# EAGLE design Aegaeon REV B 20130222 (EAGLE 6.1)
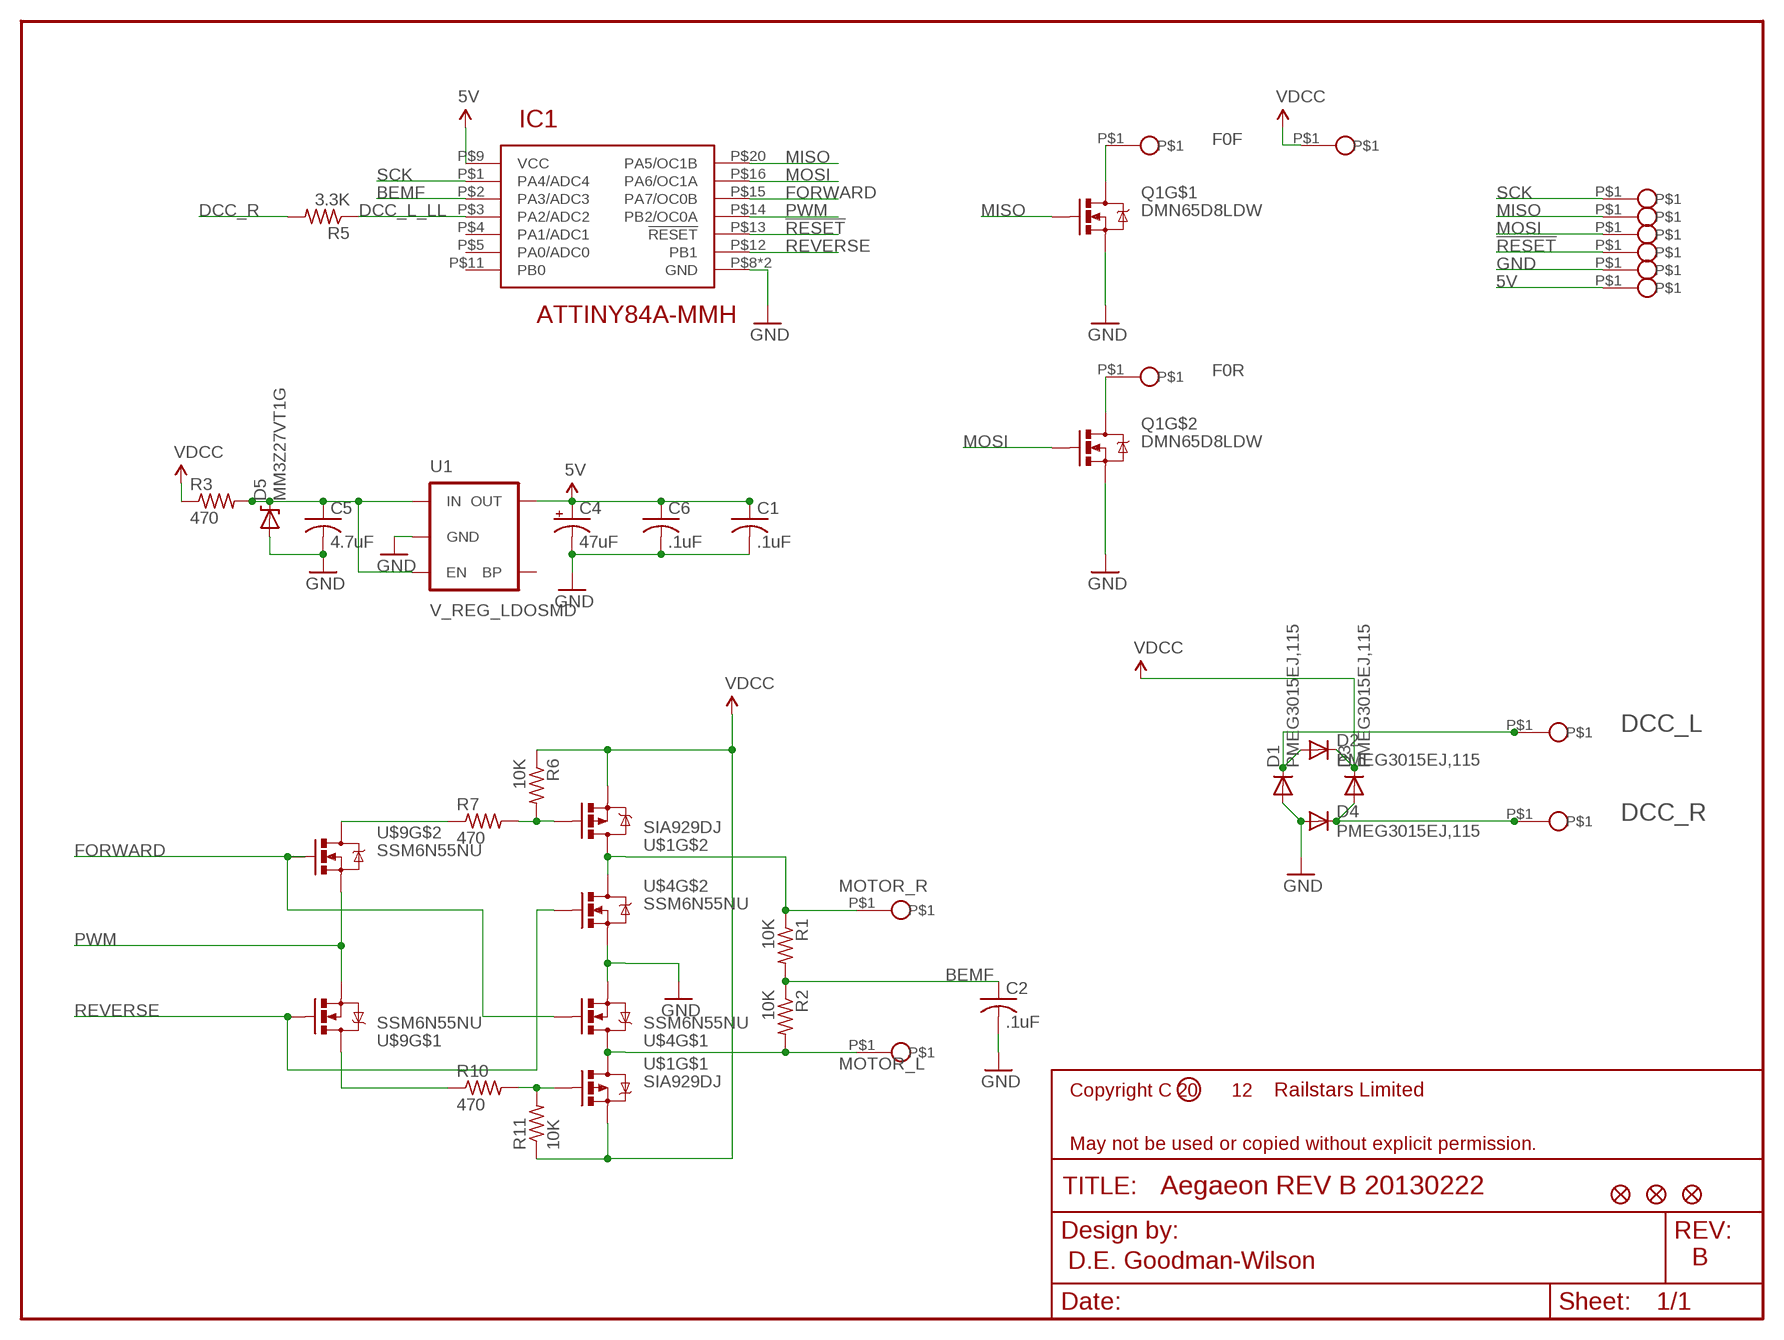
[diagram p0: schematic, sheet 1]

## Parts
C1  .1uF  C-USC0201  [C0201]
C2  .1uF  C-USC0402  [C0402]
C4  47uF  CPOL-USF980J476MMA  [CPOL0603]
C5  4.7uF  C-USC0603  [C0603]
C6  .1uF  C-USC0402  [C0402]
D1  PMEG3015EJ,115  DIODESOD  [SOD-323]
D2  PMEG3015EJ,115  DIODESOD  [SOD-323]
D3  PMEG3015EJ,115  DIODESOD  [SOD-323]
D4  PMEG3015EJ,115  DIODESOD  [SOD-323]
D5  MM3Z27VT1G  DIODE-ZENER-BZT52  [SOD-323]
DCC_L  PAD1MM  [LED_SOLDER_PAD]
DCC_R  PAD1MM  [LED_SOLDER_PAD]
IC1  ATTINY84A-MMH  [VQFN-20]
JP1  FIDUCIALUFIDUCIAL  [MICRO-FIDUCIAL]
JP2  FIDUCIALUFIDUCIAL  [MICRO-FIDUCIAL]
JP4  FIDUCIALUFIDUCIAL  [MICRO-FIDUCIAL]
Q1  DMN65D8LDW  [SOT363]
R1  10K  R-US_R0201  [R0201]
R2  10K  R-US_R0201  [R0201]
R3  470  R-US_R0201  [R0201]
R5  3.3K  R-US_R0201  [R0201]
R6  10K  R-US_R0201  [R0201]
R7  470  R-US_R0201  [R0201]
R10  470  R-US_R0201  [R0201]
R11  10K  R-US_R0201  [R0201]
U1  V_REG_LDOSMD  [SOT23-5]
U$1  SIA929DJ  [SC70-6L]
U$2  PAD1MM  [LED_SOLDER_PAD]
U$3  PAD1MM  [LED_SOLDER_PAD]
U$4  SSM6N55NU  [UDFN6]
U$5  PAD1MM  [LED_SOLDER_PAD]
U$9  SSM6N55NU  [UDFN6]
U$10  PAD1MM  [LED_SOLDER_PAD]
U$11  PAD1MM  [LED_SOLDER_PAD]
U$14  PAD.75MM  [POGO_PAD]
U$15  PAD.75MM  [POGO_PAD]
U$16  PAD.75MM  [POGO_PAD]
U$17  PAD.75MM  [POGO_PAD]
U$18  PAD.75MM  [POGO_PAD]
U$19  PAD.75MM  [POGO_PAD]

## Nets
5V: C1.1 C4.1(+) C6.1 IC1.P$9(VCC) U1.5(OUT) U$19.P$1
!RESET: IC1.P$13(!RESET) U$17.P$1
BEMF: C2.1 IC1.P$2(PA3/ADC3) R1.2 R2.1
DCC_L: D1.1(C) D2.2(A) DCC_L.P$1
DCC_L_LL: IC1.P$3(PA2/ADC2) R5.1
DCC_R: D3.2(A) D4.1(C) DCC_R.P$1 R5.2
F0F: Q1.P$4(D) U$10.P$1
F0R: Q1.P$1(D) U$5.P$1
FORWARD: IC1.P$15(PA7/OC0B) U$4.G1(G) U$9.G2(G)
GND: C1.2 C2.2 C4.2(-) C5.2 C6.2 D1.2(A) D4.2(A) D5.2(A) IC1.P$8(GND) IC1.P$21(GND) Q1.P$3(S) Q1.P$6(S) U1.2(GND) U$4.S1(S) U$4.S2(S) U$18.P$1
MISO: IC1.P$20(PA5/OC1B) Q1.P$2(G) U$15.P$1
MOSI: IC1.P$16(PA6/OC1A) Q1.P$5(G) U$16.P$1
MOTOR_L: R2.2 U$1.D1$2(D) U$1.D1(D) U$3.P$1 U$4.D1$1(D) U$4.D1(D)
MOTOR_R: R1.1 U$1.D2$2(D) U$1.D2(D) U$2.P$1 U$4.D2$2(D) U$4.D2(D)
N$1: R6.2 R7.2 U$1.G2(G)
N$2: C5.1 D5.1(C) R3.2 U1.1(IN) U1.3(EN)
N$4: R10.2 R11.2 U$1.G1(G)
N$10: R10.1 U$9.D1$1(D) U$9.D1(D)
N$11: R7.1 U$9.D2$2(D) U$9.D2(D)
PWM: IC1.P$14(PB2/OC0A) U$9.S1(S) U$9.S2(S)
REVERSE: IC1.P$12(PB1) U$4.G2(G) U$9.G1(G)
SCK: IC1.P$1(PA4/ADC4) U$14.P$1
VDCC: D2.1(C) D3.1(C) R3.1 R6.1 R11.1 U$1.S1(S) U$1.S2(S) U$11.P$1
Unconnected: IC1.P$4(PA1/ADC1) IC1.P$5(PA0/ADC0) IC1.P$11(PB0) U1.4(BP)

## Notes on the sheet
- 12 | Railstars Limited
- D.E. Goodman-Wilson | B

## Library data of the parts
C1 C2 C5 C6 = rcl:C-US: CAPACITOR, American symbol
C4 = rcl:CPOL-US: POLARIZED CAPACITOR, American symbol
D1-D4 = Railstars:DIODE: Diode These are standard reverse protection diodes and small signal diodes. SMA package can handle up to about 1A. SOD-323 can handle about 200mA. What the SOD-323 package when ordering, there are some mfgs out there that are 5-pin packages.
D5 = SparkFun-DiscreteSemi:DIODE-ZENER: Zener Diode Production Part - 8199 3.4V Zener Voltage
DCC_L DCC_R U$2 U$3 U$5 U$10 U$11 U$14-U$19 = Railstars:PAD
IC1 = Railstars:ATTINY84A
JP1 JP2 JP4 = SparkFun-Aesthetics:FIDUCIAL: Fiducial Alignment Points Various fiducial points for machine vision alignment.
Q1 = Railstars:DMN65D8LDW
R1-R3 R5-R7 R10 R11 = rcl:R-US_: RESISTOR, American symbol
U1 = SparkFun-PowerIC:V_REG_LDO: Voltage Regulator LDO Standard 150mA LDO voltage regulator in SOT-23 layout. Micrel part MIC5205. BP (by-pass) pin is used to lower output noise with 470pF cap.
U$1 = Railstars:SIA929DJ
U$4 U$9 = Railstars:SSM6N55NU

## Board
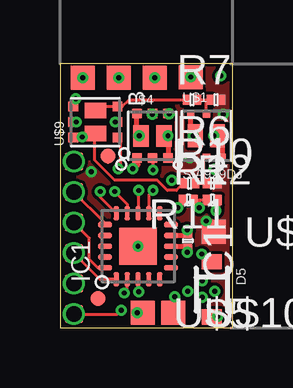
[diagram p1: board, top side]
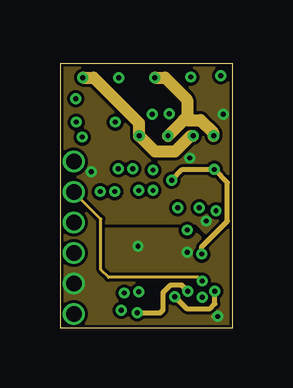
[diagram p2: board, inner layer Route8]
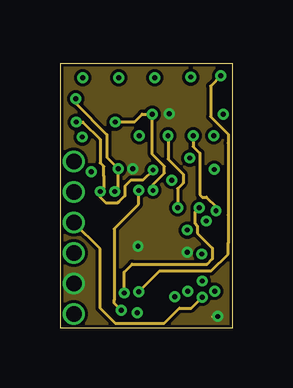
[diagram p3: board, inner layer Route9]
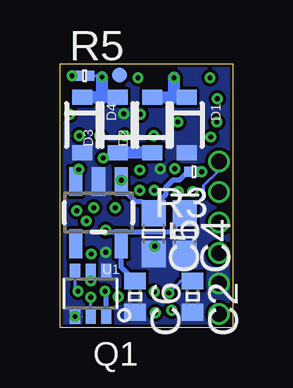
[diagram p4: board, bottom side, seen from below]

Size 7.2 x 11 mm. Coordinates in mm from the lower left corner, seen from the top.
Outline: 0,0 7.2,0 7.2,11 0,11 0,0
Copper layers (1*8+9*16): Top 0.035mm / dielectric 0.15mm / Route8 0.035mm / dielectric 0.15mm / Route9 0.035mm / dielectric 0.15mm / Bottom 0.035mm
Design rules: minimum track width 5mil, minimum drill 0.2mm, track to track 5mil, track to pad 5mil, pad to pad 5mil, via to via 5mil, smd to smd 0mil, copper to edge 5mil, drill to drill 10mil, minimum pad ring 5mil, minimum via ring 5mil, stop-mask expansion 0.05mm, vias tented up to drill 100mil, thermal gap 0.25mm

### Footprints (pad centres in the part's own frame; a part is rotated, then mirrored left to right if it is on the bottom)
C0201 = smd 0.25 x 0.35: 1 -0.25,0; 2 0.25,0
C0402 = smd 0.7 x 0.9: 1 -0.65,0; 2 0.65,0
CPOL0603 = smd 1.1 x 1: 1 -0.85,0; 2 0.85,0
C0603 = smd 1.1 x 1: 1 -0.85,0; 2 0.85,0
SOD-323 = smd 0.63 x 0.83: 1 -1.15,0; 2 1.15,0
LED_SOLDER_PAD = smd 1 x 1: P$1 0,0
VQFN-20 = smd 0.6 x 0.22: P$1 -1.375,0.9; P$2 -1.375,0.45; P$3 -1.375,0; P$4 -1.375,-0.45; P$5 -1.375,-0.9; P$11 1.375,-0.9; P$12 1.375,-0.45; P$13 1.375,0; P$14 1.375,0.45; P$15 1.375,0.9 | smd 0.22 x 0.6: P$6 -0.9,-1.375; P$7 -0.45,-1.375; P$8 0,-1.375; P$9 0.45,-1.375; P$10 0.9,-1.375; P$16 0.9,1.375; P$17 0.45,1.375; P$18 0,1.375; P$19 -0.45,1.375; P$20 -0.9,1.375 | smd 1.55 x 1.55: P$21 0,0
MICRO-FIDUCIAL = smd 0.635 x 0.635: 1 0,0
SOT363 = smd 0.42 x 0.6: P$1 -0.65,0.95; P$2 0,0.95; P$3 0.65,0.95; P$4 0.65,-0.95; P$5 0,-0.95; P$6 -0.65,-0.95
R0201 = smd 0.28 x 0.43: 1 -0.255,0; 2 0.255,0
SOT23-5 = smd 0.55 x 1.2: 1 -0.95,-1.3; 2 0,-1.3; 3 0.95,-1.3; 4 0.95,1.3; 5 -0.95,1.3
SC70-6L = smd 0.3 x 0.325: D1 -0.65,0.912; D2 0.65,-0.912; G1 0,-0.912; G2 0,0.912; S1 -0.65,-0.912; S2 0.65,0.912 | smd 0.613 x 0.95: D1$2 -0.467,0; D2$2 0.467,0
UDFN6 = smd 0.4 x 0.4: D1 -0.65,0.925; D2 0.65,-0.925; G1 0,-0.925; G2 0,0.925; S1 -0.65,-0.925; S2 0.65,0.925 | smd 0.65 x 0.9: D1$1 -0.475,0; D2$2 0.475,0
POGO_PAD = smd 0.75 x 0.75: P$1 0,0

### Placement (x,y rotation side)
C1  5.33,3.62 270 top
C2  1.67,1.3 270 bottom
C4  2,3.92 270 bottom
C5  3.3,3.92 270 bottom
C6  4.08,1.3 270 bottom
D1  1.92,8.45 270 bottom
D2  3.35,8.45 90 bottom
D3  4.8,8.45 90 bottom
D4  6.28,8.45 270 bottom
D5  6.33,1.6 270 top
DCC_L  2.45,10.43 0 top
DCC_R  5.45,10.45 0 top
IC1  3.25,3.4 90 top
JP1  1.58,1.23 0 top
JP2  2,7.15 0 top
JP4  4.73,10.53 0 bottom
Q1  5.93,1.43 180 bottom
R1  5.35,5.33 0 top
R2  6.35,5.33 0 top
R3  1.62,6.5 180 bottom
R5  6.18,10.5 0 bottom
R6  6.5,9.5 180 top
R7  5.5,9.5 0 top
R10  5.4,6.03 0 top
R11  6.35,6.03 180 top
U1  5.6,4.8 180 bottom
U$1  6.1,8 0 top
U$2  3.95,10.43 0 top
U$3  0.95,10.43 0 top
U$4  3.85,8 0 top
U$5  3.44,0.62 0 top
U$9  1.48,8.57 90 top
U$10  4.71,0.62 0 top
U$11  6.4,4 0 top
U$14  0.57,3.12 0 top
U$15  0.57,4.38 0 top
U$16  0.57,5.66 0 top
U$17  0.57,0.57 0 top
U$18  0.57,1.84 0 top
U$19  0.57,6.92 0 top

### Tracks (layer width: path | path; a pad name or v marks a point on that pad's centre or on a via)
5V  (via drill 0.2, 0.65)
  Top 0.127: 5.3,3.85 C1.1
  Top 0.2: v5.3,4.08 C1.1 5.3,3.85 IC1.P$9
  Bottom 0.127: U$19.P$1 0.57,6.58 1.23,5.92 1.23,5.47 1.58,5.12 1.65,5.12 C4.1
  Bottom 0.2: C4.1 2.4,4.38 2.4,4.15 2.57,3.98 4.65,3.98 | C6.1 4.65,2.52 U1.5 4.65,3.65 4.65,3.98 | 4.65,3.98 5.2,3.98 v5.3,4.08
  other vias: 0.57,6.92
!RESET  (via drill 0.2, 0.65)
  Top 0.127: v3.27,5.72 3.25,5.7 IC1.P$13 | U$17.P$1 2.4,0.57 v2.55,0.73
  Route9 0.127: v3.27,5.72 3.27,5.15 2.25,4.12 2.25,1.15 2.25,1.03 v2.55,0.73
  other vias: 0.57,0.57
BEMF  (via drill 0.2)
  Top 0.127: R2.1 5.8,5.33 | 5.8,5.33 v5.8,5 5.8,5.33 | R1.2 5.8,5.33 | v2.67,1.45 2.8,1.57 IC1.P$2
  Route9 0.127: v2.67,1.45 2.67,2.33 3,2.65 6.12,2.65 6.35,2.88 6.35,3.33 5.73,3.95 5.73,4.25 5.62,4.35 5.62,4.83 v5.8,5
  Bottom 0.127: C2.1 2.17,1.95 v2.67,1.45
DCC_L  (via drill 0.2)
  Bottom 0.5: D2.2 D1.1 2.45,9.6 DCC_L.P$1
  other vias: 2.45,10.43
DCC_L_LL  (via drill 0.2)
  Top 0.127: v3.27,1.5 3.25,1.52 IC1.P$3
  Route9 0.127: v6.7,10.5 6.28,10.07 6.28,8.8 7,8.07 7,7.7 7,4.7 7,3.52 7,3.08 6.3,2.38 4.15,2.38 v3.27,1.5
  Bottom 0.127: R5.1 v6.7,10.5
DCC_R  (via drill 0.2)
  Bottom 0.127: R5.2 5.45,10.5 DCC_R.P$1
  Bottom 0.5: D3.2 D4.1 5.45,9.6 DCC_R.P$1
  other vias: 5.45,10.45
F0F  (via drill 0.2)
  Top 0.127: U$10.P$1 4.7,0.64
  Top 0.2: U$10.P$1 4.73,0.64 4.78,0.69 v4.78,1.3
  Route8 0.2: v4.78,1.3 5.28,0.8 6.25,0.8 6.45,1 v6.45,1.52
  Bottom 0.127: v6.45,1.52 6.58,1.65 Q1.P$4
F0R  (via drill 0.2)
  Top 0.2: U$5.P$1 3.2,0.62 v3.23,0.62
  Route8 0.2: v5.33,1.52 5.08,1.77 4.6,1.77 4.3,1.48 4.3,0.75 4.17,0.62 U$5.P$1 v3.23,0.62
  Bottom 0.2: Q1.P$1 5.28,1.48 v5.33,1.52
FORWARD  (via drill 0.2)
  Top 0.127: v0.68,8.57 U$9.G2 | IC1.P$15 1.67,5.45 v1.67,5.68 | v3.88,6.58 3.88,7.05 U$4.G1
  Route9 0.127: v0.68,8.57 0.95,8.57 1.67,7.85 1.67,6.88 1.83,6.72 1.83,6.33 1.83,5.83 v1.67,5.68 1.67,5.45 1.92,5.2 2.4,5.2 2.45,5.25 2.7,5.5 2.7,5.62 2.7,5.9 2.95,6.15 3.45,6.15 v3.88,6.58
GND  (via drill 0.2, 0.65)  (1 unrouted)
  Top 0.127: 5.3,3.4 C1.2
  Top 0.2: IC1.P$8 5.3,3.4 | 5.35,3.4 C1.2 v5.3,3.15 | 6.3,0.47 v6.58,0.47
  Top 0.3: v3.02,6.62 3.2,6.8 U$4.S1
  Top 0.4: U$4.S2 4.5,8.88 v4.55,8.93
  Bottom 0.127: 2.2,7.3 D1.2
  other vias: 0.57,1.84 3.25,3.4
  pour Bottom (no thermals): 0,0 0,11 7.2,11 7.2,0
  pour Route9: 7.2,11 0,11 0,0 7.2,0
  pour Route8 (rank 2): 0,0 7.2,0 7.2,5.28 0,5.28
MISO  (via drill 0.2, 0.65)
  Top 0.127: IC1.P$20 1.58,2.5 1.23,2.85 1.23,3.73 U$15.P$1
  Route9 0.127: v5.93,1.27 5.48,0.82 4.98,0.82 4.35,0.2 2.3,0.2 1.67,0.82 1.67,3.15 1.67,3.29 U$15.P$1
  Bottom 0.127: Q1.P$2 5.93,0.88 v5.93,1.27
  other vias: 0.57,4.38
MOSI  (via drill 0.2, 0.65)
  Top 0.127: IC1.P$16 1.85,4.3 1.85,4.38 U$16.P$1
  Route8 0.127: v5.93,1.95 5.78,2.1 2.02,2.1 1.7,2.42 1.7,4.53 U$16.P$1
  Bottom 0.127: v5.93,1.95 Q1.P$5
  other vias: 0.57,5.66
MOTOR_L  (via drill 0.2)
  Top 0.127: U$4.D1$1 3.38,7.92 v3.3,8 | R2.2 6.61,4.98 v6.5,4.88
  Top 0.2: U$1.D1$2 v5.55,8 5.45,8 U$1.D1 | v3.3,8 3.2,8 U$4.D1
  Route8 0.5: v5.55,8 5.45,8 4.8,7.35 3.95,7.35 v3.3,8 3.3,8.53 2.55,9.28 1.4,10.43 U$3.P$1
  Route9 0.127: v5.55,8 5.55,7.55 5.83,7.28 5.83,5.55 5.93,5.45 6.1,5.45 6.5,5.05 v6.5,4.88
  other vias: 0.95,10.43
MOTOR_R  (via drill 0.2)
  Top 0.127: v4.5,8 4.33,7.83 U$4.D2$2 | v4.9,5 5.1,5.2 R1.1
  Top 0.2: v4.5,8 U$4.D2 | U$1.D2$2 v6.4,8 6.75,8 U$1.D2
  Route8 0.5: U$2.P$1 4.38,10.43 5.3,9.5 5.3,8.65 | 5.3,8.65 5.85,8.65 6.4,8.1 v6.4,8 | 5.3,8.65 5.15,8.65 v4.5,8
  Route9 0.127: v4.5,8 4.5,7.03 5.12,6.4 5.12,6.03 4.9,5.8 4.9,5.2 v4.9,5
  other vias: 3.95,10.43
N$1
  Top 0.127: R7.2 R6.2 6.1,9.5 U$1.G2
N$2  (via drill 0.2)
  Top 0.2: D5.1 6,3.08 v5.9,3.08
  Route8 0.2: v4.65,6.15 5.1,6.6 v6.43,6.6 6.98,6.05 6.98,4.45 5.9,3.38 v5.9,3.08
  Bottom 0.2: R3.2 2.23,6.15 2.5,6.15 2.8,5.85 2.8,5.55 3.3,5.05 C5.1 3.77,5.25 4.05,5.25 4.65,5.85 U1.1 v4.65,6.15 | 6.4,6.25 U1.3 6.43,6.22 v6.43,6.6
N$4
  Top 0.127: U$1.G1 5.98,6.96 5.98,6.03 | 5.98,6.03 R11.2 5.98,6.03 | R10.2 5.98,6.03
N$10  (via drill 0.2)
  Top 0.127: U$9.D1 0.57,7.95 v0.93,7.95 1.45,7.95 | R10.1 4.85,5.72 4.48,5.72 4.05,6.15 3.7,6.15 2.27,6.15 1.45,6.97 1.45,7.95 | 1.45,7.95 1.45,8.07 U$9.D1$1
N$11
  Top 0.127: U$9.D2$2 1.65,9.22 U$9.D2 2.6,9.22 2.88,9.5 4.85,9.5 R7.1
PWM  (via drill 0.2)
  Top 0.127: v2.42,6.62 2.52,6.72 2.52,7.8 U$9.S1 | U$9.S2 0.65,9.32 v0.65,9.55 | v2.27,5.68 2.8,5.16 IC1.P$14
  Route9 0.127: v0.65,9.55 0.65,9.35 1.95,8.05 1.95,7.1 v2.42,6.62 2.42,5.83 v2.27,5.68
REVERSE  (via drill 0.2)
  Top 0.127: v2.3,8.57 U$9.G1 | v3.85,8.9 U$4.G2 | v3.88,5.72 3.7,5.55 IC1.P$12
  Route9 0.127: v2.3,8.57 3.1,8.57 3.42,8.9 v3.85,8.9 3.85,7.22 4.08,7 4.35,6.72 4.35,6.45 3.88,5.97 v3.88,5.72
SCK  (via drill 0.65)
  Top 0.127: IC1.P$1 1.71,2.02 1.67,2.02 U$14.P$1
  other vias: 0.57,3.12
VDCC  (via drill 0.2)
  Bottom 0.127: R3.1 v1.3,6.5
  Bottom 0.2: v5.4,7.08 5.03,7.08 D3.1 4.65,7.3 4.65,7.15
  Bottom 0.5: D2.1 D3.1
  other vias: 6.8,8.9 6.1,4.45
  pour Top (no thermals): 0,11 7.2,11 7.2,0 0,0
  pour Route8 (no thermals): 0,11 7.2,11 7.2,3.45 6.55,3.45 5.68,4.35 0,4.35

### Text on the board
tPlace: B
tDocu: Aegaeon:L2 DCC Decoder | Copyright (C) 2013, Railstars Limited | All Rights Reserved